# EAGLE design LED_8x8 (EAGLE 6.4)
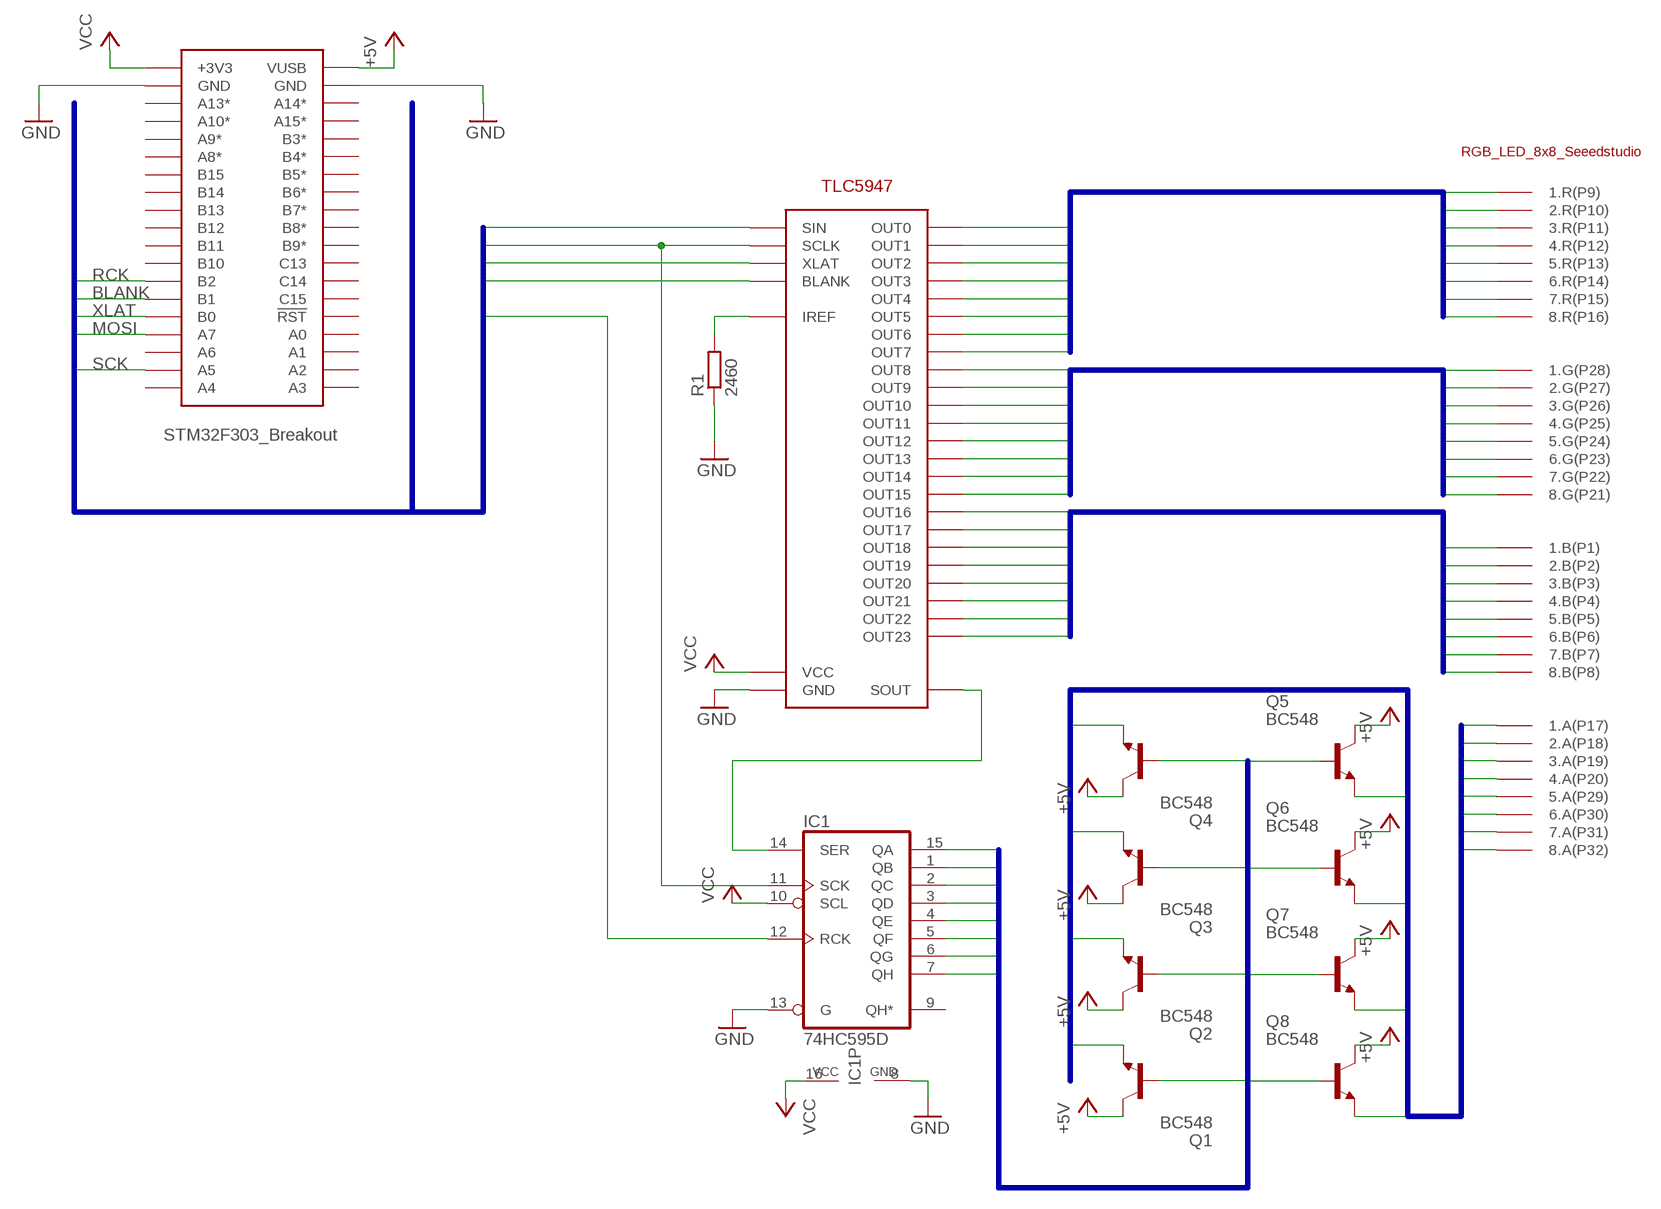
[diagram p0: schematic, sheet 1]

## Parts
IC1  74HC595D  [SO16]
Q1  BC548  [TO92-EBC]
Q2  BC548  [TO92-EBC]
Q3  BC548  [TO92-EBC]
Q4  BC548  [TO92-EBC]
Q5  BC548  [TO92-EBC]
Q6  BC548  [TO92-EBC]
Q7  BC548  [TO92-EBC]
Q8  BC548  [TO92-EBC]
R1  2460  R-EU_R0603  [R0603]
U$1  TLC5947  [TSSOP32]
U$2  STM32F303_BREAKOUT  [STM32_BREAKOUT]
U$3  LED_RGB_8X8  [LED_RGB_8X8]

## Nets
+5V: Q1.C Q2.C Q3.C Q4.C Q5.C Q6.C Q7.C Q8.C U$2.VUSB
BLANK: U$1.BLANK U$2.B1
BLUE1: U$1.OUT16 U$3.P1(1.B(P1))
BLUE2: U$1.OUT17 U$3.P2(2.B(P2))
BLUE3: U$1.OUT18 U$3.P3(3.B(P3))
BLUE4: U$1.OUT19 U$3.P4(4.B(P4))
BLUE5: U$1.OUT20 U$3.P5(5.B(P5))
BLUE6: U$1.OUT21 U$3.P6(6.B(P6))
BLUE7: U$1.OUT22 U$3.P7(7.B(P7))
BLUE8: U$1.OUT23 U$3.P8(8.B(P8))
GND: IC1.8(GND) IC1.13(G) R1.1 U$1.GND U$2.GND@1(GND) U$2.GND@2(GND)
GREEN1: U$1.OUT8 U$3.P28(1.G(P28))
GREEN2: U$1.OUT9 U$3.P27(2.G(P27))
GREEN3: U$1.OUT10 U$3.P26(3.G(P26))
GREEN4: U$1.OUT11 U$3.P25(4.G(P25))
GREEN5: U$1.OUT12 U$3.P24(5.G(P24))
GREEN6: U$1.OUT13 U$3.P23(6.G(P23))
GREEN7: U$1.OUT14 U$3.P22(7.G(P22))
GREEN8: U$1.OUT15 U$3.P21(8.G(P21))
MOSI: U$1.SIN U$2.A7
N$1: IC1.14(SER) U$1.SOUT
N$7: R1.2 U$1.IREF
POWERA1: Q1.E U$3.P17(1.A(P17))
POWERA2: Q2.E U$3.P18(2.A(P18))
POWERA3: Q3.E U$3.P19(3.A(P19))
POWERA4: Q4.E U$3.P20(4.A(P20))
POWERA5: Q5.E U$3.P29(5.A(P29))
POWERA6: Q6.E U$3.P30(6.A(P30))
POWERA7: Q7.E U$3.P31(7.A(P31))
POWERA8: Q8.E U$3.P32(8.A(P32))
RCK: IC1.12(RCK) U$2.B2
RED1: U$1.OUT0 U$3.P9(1.R(P9))
RED2: U$1.OUT1 U$3.P10(2.R(P10))
RED3: U$1.OUT2 U$3.P11(3.R(P11))
RED4: U$1.OUT3 U$3.P12(4.R(P12))
RED5: U$1.OUT4 U$3.P13(5.R(P13))
RED6: U$1.OUT5 U$3.P14(6.R(P14))
RED7: U$1.OUT6 U$3.P15(7.R(P15))
RED8: U$1.OUT7 U$3.P16(8.R(P16))
SCK: IC1.11(SCK) U$1.SCLK U$2.A5
SHIFTA1: IC1.15(QA) Q1.B
SHIFTA2: IC1.1(QB) Q2.B
SHIFTA3: IC1.2(QC) Q3.B
SHIFTA4: IC1.3(QD) Q4.B
SHIFTA5: IC1.4(QE) Q5.B
SHIFTA6: IC1.5(QF) Q6.B
SHIFTA7: IC1.6(QG) Q7.B
SHIFTA8: IC1.7(QH) Q8.B
VCC: IC1.10(SCL) IC1.16(VCC) U$1.VCC U$2.+3V3
XLAT: U$1.XLAT U$2.B0
Unconnected: IC1.9(QH*) U$2.!RST U$2.A0 U$2.A1 U$2.A2 U$2.A3 U$2.A4 U$2.A6 U$2.A8* U$2.A9* U$2.A10* U$2.A13* U$2.A14* U$2.A15* U$2.B3* U$2.B4* U$2.B5* U$2.B6* U$2.B7* U$2.B8* U$2.B9* U$2.B10 U$2.B11 U$2.B12 U$2.B13 U$2.B14 U$2.B15 U$2.C13 U$2.C14 U$2.C15

## Buses
RED[1..8]
GREEN[1..8]
BLUE[1..8]
CONTROLA[1..8]
POWERA[1..8]
MOSI,SCK,XLAT,BLANK,RCK

## Library data of the parts
IC1 = 74xx-eu:74*595: 8-bit SHIFT REGISTER, output latch
Q1-Q8 = transistor-npn:BC548*: NPN Transistor
R1 = rcl:R-EU_: RESISTOR, European symbol
U$1 = shack:TLC5947
U$2 = shack:STM32F303_BREAKOUT
U$3 = shack:LED_RGB_8X8

## Board
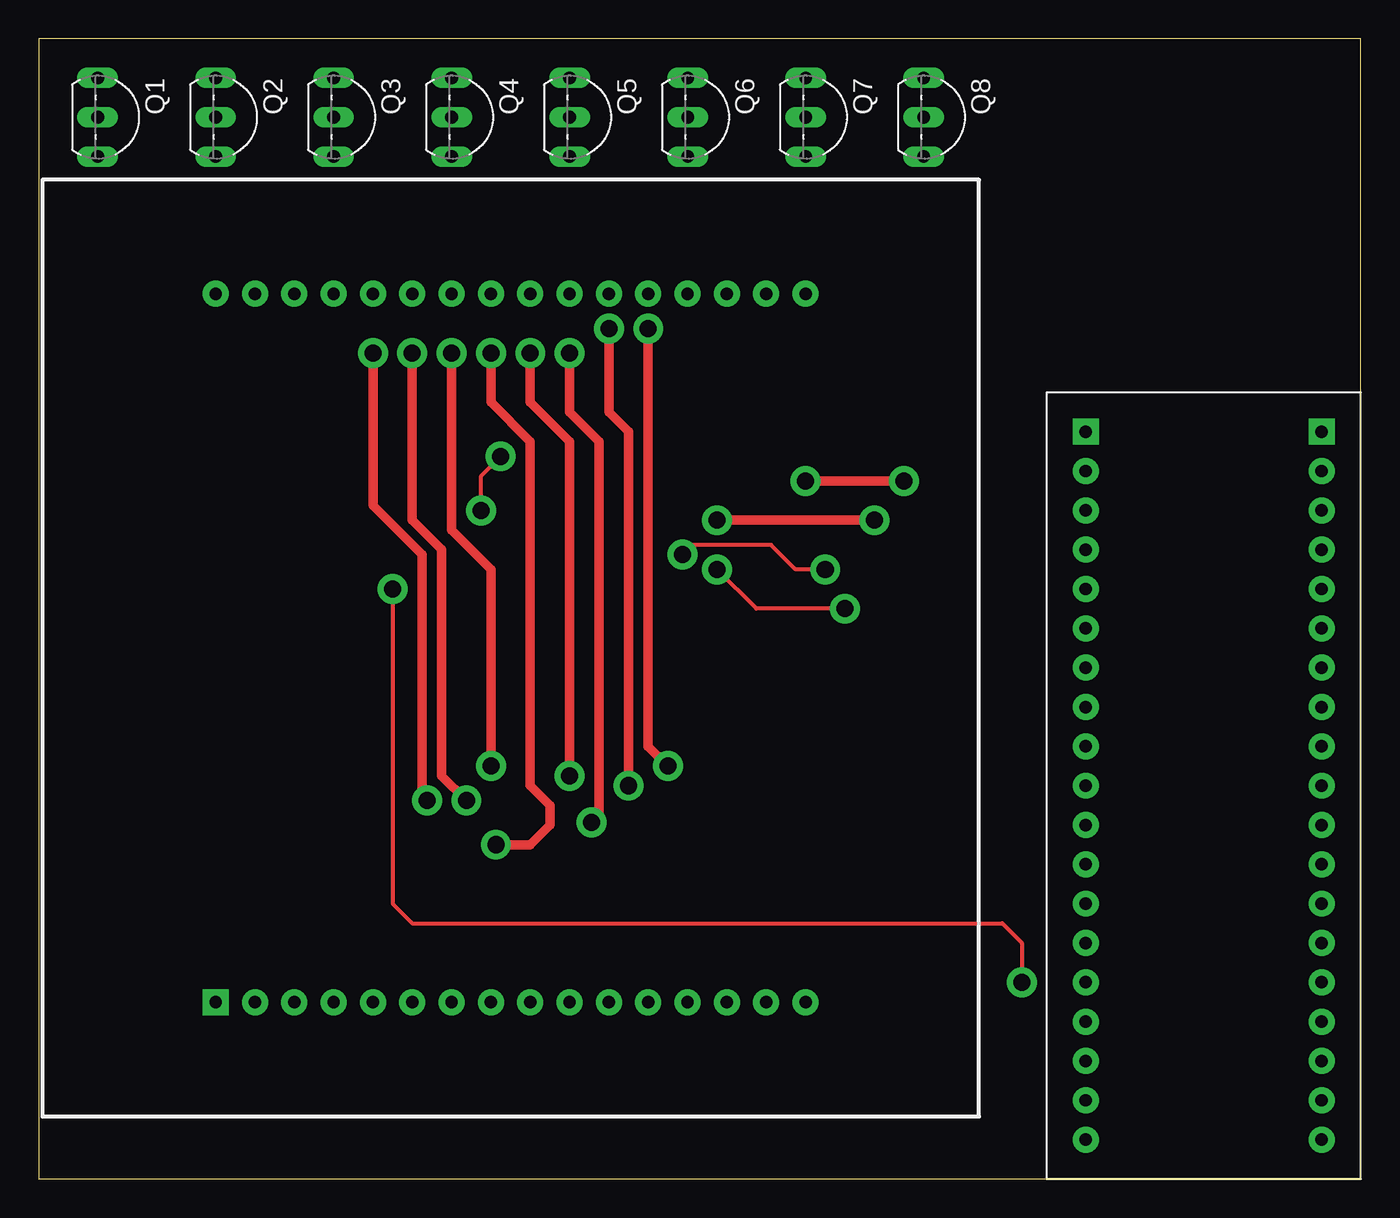
[diagram p1: board, top side]
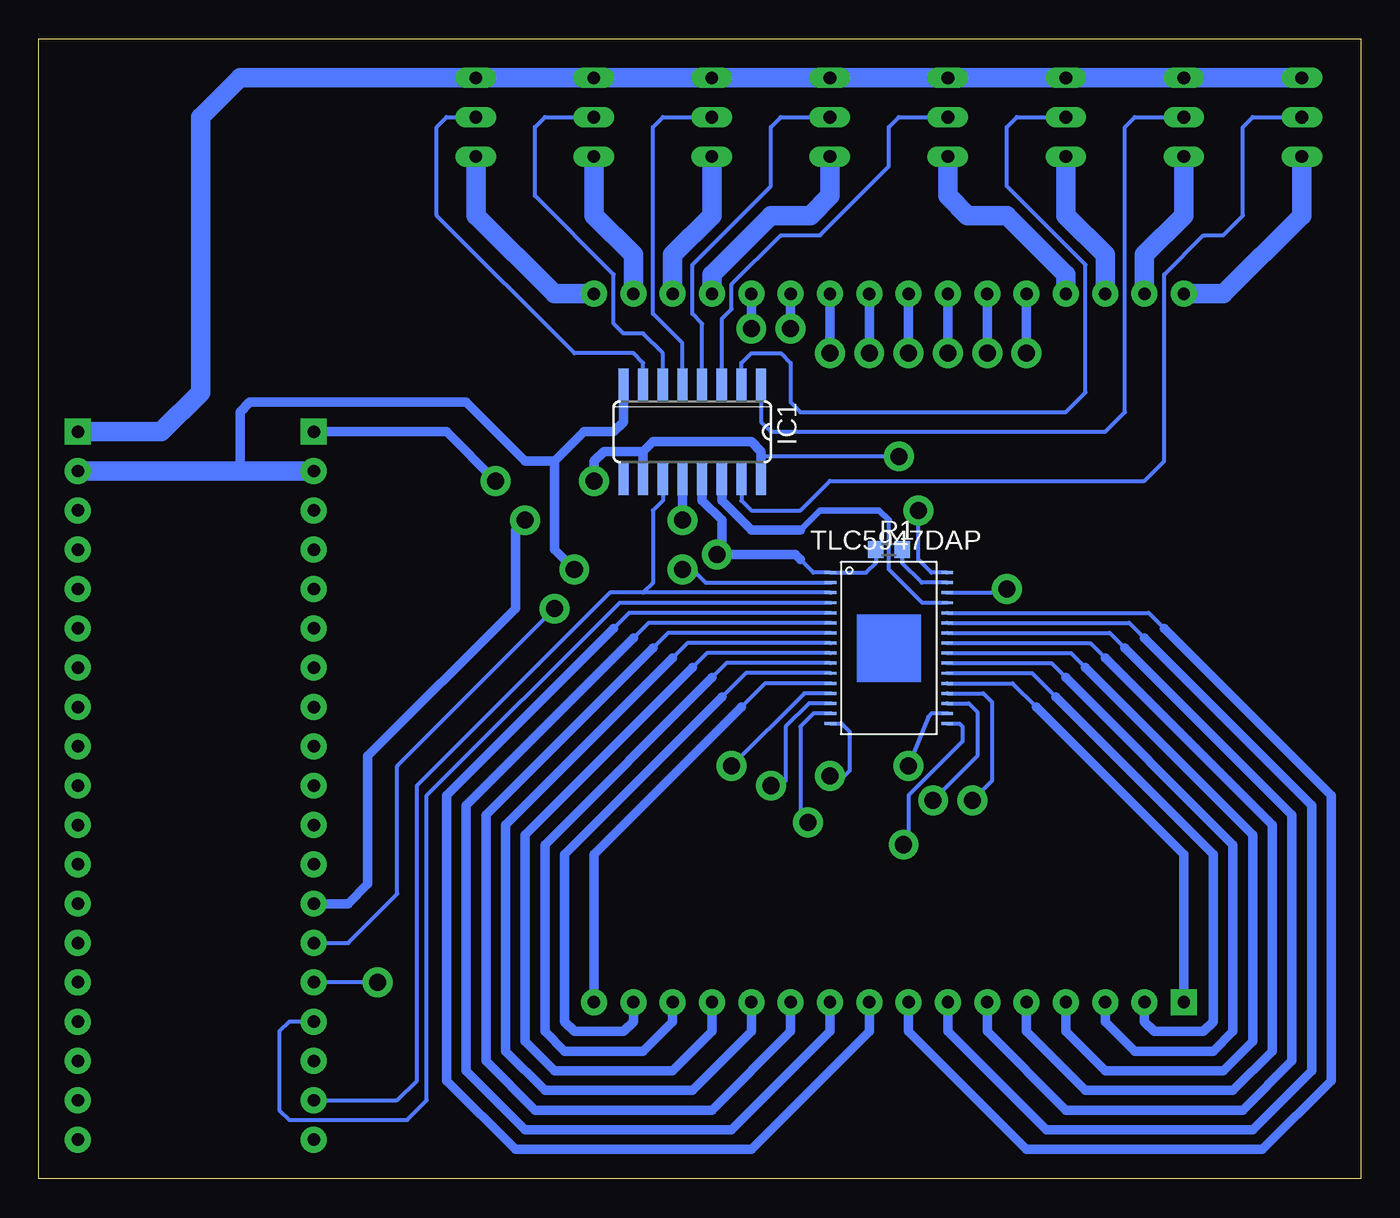
[diagram p2: board, bottom side, seen from below]

Size 85.39 x 73.65 mm. Coordinates in mm from the lower left corner, seen from the top.
Outline: 0,0 85.39,0 85.39,73.65 0,73.65 0,0
Copper layers (1*16): Top 0.035mm / dielectric 1.5mm / Bottom 0.035mm
Design rules "default": minimum track width 10mil, minimum drill 24mil, track to track 8mil, track to pad 8mil, pad to pad 8mil, via to via 8mil, smd to smd 8mil, copper to edge 40mil, drill to drill 8mil, minimum pad ring 10mil, minimum via ring 8mil, stop-mask expansion 4mil, vias tented up to drill 0mil, thermal gap 10mil

### Footprints (pad centres in the part's own frame; a part is rotated, then mirrored left to right if it is on the bottom)
SO16 = smd 0.66 x 2.032: 1 -4.445,-3.073; 2 -3.175,-3.073; 3 -1.905,-3.073; 4 -0.635,-3.073; 5 0.635,-3.073; 6 1.905,-3.073; 7 3.175,-3.073; 8 4.445,-3.073; 9 4.445,3.073; 10 3.175,3.073; 11 1.905,3.073; 12 0.635,3.073; 13 -0.635,3.073; 14 -1.905,3.073; 15 -3.175,3.073; 16 -4.445,3.073
TO92-EBC = drill 0.813 long: B 0,-1.27; C -2.54,-1.27; E 2.54,-1.27
R0603 = smd 1 x 1.1: 1 -0.85,0; 2 0.85,0
TSSOP32 = smd 0.75 x 0.19: BLANK -3.775,4.225; GND -3.775,4.875; IREF 3.775,4.225; OUT0 -3.775,2.275; OUT1 -3.775,1.625; OUT2 -3.775,0.975; OUT3 -3.775,0.325; OUT4 -3.775,-0.325; OUT5 -3.775,-0.975; OUT6 -3.775,-1.625; OUT7 -3.775,-2.275; OUT8 -3.775,-2.925; OUT9 -3.775,-3.575; OUT10 -3.775,-4.225; OUT11 -3.775,-4.875; OUT12 3.775,-4.875; OUT13 3.775,-4.225; OUT14 3.775,-3.575; OUT15 3.775,-2.925; OUT16 3.775,-2.275; OUT17 3.775,-1.625; OUT18 3.775,-0.975; OUT19 3.775,-0.325; OUT20 3.775,0.325; OUT21 3.775,0.975; OUT22 3.775,1.625; OUT23 3.775,2.275; SCLK -3.775,3.575; SIN -3.775,2.925; SOUT 3.775,2.925; VCC 3.775,4.875; XLAT 3.775,3.575
STM32_BREAKOUT = drill 0.8 pad 1.676: !RST 7.62,-12.7; A0 7.62,-15.24; A1 7.62,-17.78; A2 7.62,-20.32; A3 7.62,-22.86; A4 -7.62,-22.86; A5 -7.62,-20.32; A6 -7.62,-17.78; A7 -7.62,-15.24; A8* -7.62,10.16; A9* -7.62,12.7; A10* -7.62,15.24; A13* -7.62,17.78; A14* 7.62,17.78; A15* 7.62,15.24; B0 -7.62,-12.7; B1 -7.62,-10.16; B2 -7.62,-7.62; B3* 7.62,12.7; B4* 7.62,10.16; B5* 7.62,7.62; B6* 7.62,5.08; B7* 7.62,2.54; B8* 7.62,0; B9* 7.62,-2.54; B10 -7.62,-5.08; B11 -7.62,-2.54; B12 -7.62,0; B13 -7.62,2.54; B14 -7.62,5.08; B15 -7.62,7.62; C13 7.62,-5.08; C14 7.62,-7.62; C15 7.62,-10.16; GND@1 -7.62,20.32; GND@2 7.62,20.32 | drill 0.8 pad 1.676 square: +3V3 -7.62,22.86; VUSB 7.62,22.86
LED_RGB_8X8 = drill 0.8 pad 1.676 square: P1 -19.05,-22.88 | drill 0.8 pad 1.676: P2 -16.51,-22.88; P3 -13.97,-22.88; P4 -11.43,-22.88; P5 -8.89,-22.88; P6 -6.35,-22.88; P7 -3.81,-22.88; P8 -1.27,-22.88; P9 1.27,-22.88; P10 3.81,-22.88; P11 6.35,-22.88; P12 8.89,-22.88; P13 11.43,-22.88; P14 13.97,-22.88; P15 16.51,-22.88; P16 19.05,-22.88; P17 -19.05,22.88; P18 -16.51,22.88; P19 -13.97,22.88; P20 -11.43,22.88; P21 -8.89,22.88; P22 -6.35,22.88; P23 -3.81,22.88; P24 -1.27,22.88; P25 1.27,22.88; P26 3.81,22.88; P27 6.35,22.88; P28 8.89,22.88; P29 11.43,22.88; P30 13.97,22.88; P31 16.51,22.88; P32 19.05,22.88

### Placement (x,y rotation side)
IC1  43.18,48.26 180 bottom
Q1  5.08,68.58 270 top
Q2  12.7,68.58 270 top
Q3  20.32,68.58 270 top
Q4  27.94,68.58 270 top
Q5  35.56,68.58 270 top
Q6  43.18,68.58 270 top
Q7  50.8,68.58 270 top
Q8  58.42,68.58 270 top
R1  30.48,40.64 0 bottom
U$1  30.48,34.29 0 bottom
U$2  75.25,25.4 0 top
U$3  30.48,34.29 0 top

### Tracks (layer width: path | path; a pad name or v marks a point on that pad's centre or on a via)
+5V
  Bottom 1.27: U$2.VUSB 77.47,48.26 74.93,50.8 74.93,68.58 72.39,71.12 Q8.C Q7.C Q6.C Q5.C Q4.C Q3.C Q2.C Q1.C
BLANK  (via drill 1.1 pad 1.93)
  Top 0.254: v52.07,36.83 46.35,36.83 v43.81,39.37
  Bottom 0.254: U$2.B1 65.41,15.24 62.23,18.41 62.23,26.67 v52.07,36.83 | v43.81,39.37 43.18,39.37 42.33,38.52 U$1.BLANK
BLUE1
  Bottom 0.254: U$1.OUT16 22.49,32.02 20.95,30.48
  Bottom 0.61: U$3.P1 11.43,20.95 20.95,30.48
BLUE2
  Bottom 0.254: U$1.OUT17 21.23,32.66 19.68,31.11
  Bottom 0.61: U$3.P2 13.97,10.16 13.34,9.53 10.16,9.53 9.53,10.16 9.53,20.95 19.68,31.11
BLUE3
  Bottom 0.254: U$1.OUT18 19.98,33.31 19.05,32.38
  Bottom 0.61: U$3.P3 16.51,10.16 14.61,8.26 9.53,8.26 8.26,9.53 8.26,21.59 19.05,32.38
BLUE4
  Bottom 0.254: U$1.OUT19 18.73,33.97 17.78,33.02
  Bottom 0.61: U$3.P4 19.05,9.53 16.51,6.99 8.89,6.99 6.99,8.89 6.99,22.23 17.78,33.02
BLUE5
  Bottom 0.254: U$1.OUT20 17.47,34.62 16.51,33.66
  Bottom 0.61: U$3.P5 21.59,9.53 17.78,5.71 8.26,5.71 5.71,8.26 5.71,22.86 16.51,33.66
BLUE6
  Bottom 0.254: U$1.OUT21 16.21,35.27 15.24,34.29
  Bottom 0.61: U$3.P6 24.13,9.53 19.05,4.45 7.62,4.45 4.45,7.62 4.45,23.5 15.24,34.29
BLUE7
  Bottom 0.254: U$1.OUT22 14.96,35.91 13.97,34.92
  Bottom 0.61: U$3.P7 26.67,9.53 20.32,3.17 6.99,3.17 3.17,6.99 3.17,24.13 13.97,34.92
BLUE8
  Bottom 0.254: U$1.OUT23 13.71,36.56 12.7,35.56
  Bottom 0.61: U$3.P8 29.21,9.53 21.59,1.91 6.35,1.91 1.91,6.35 1.91,24.77 12.7,35.56
GND  (via drill 1.1 pad 1.93)
  Top 0.254: v50.8,39.37 48.9,39.37 47.31,40.96 42.23,40.96 v41.59,40.32
  Top 0.61: 41.91,40.64 v41.59,40.32
  Bottom 0.254: R1.1 31.33,39.79 31.95,39.16 U$1.GND 35.35,39.16 36.2,40.01
  Bottom 0.61: IC1.8 47.62,48.9 48.26,48.26 50.16,48.26 52.07,46.35 | 36.2,40.01 36.51,40.32 v41.59,40.32 41.27,40.64 41.27,42.55 42.55,43.81 IC1.13 | 52.07,46.35 52.07,40.64 v50.8,39.37 | 52.07,46.35 53.98,46.35 57.78,50.16 71.75,50.16 72.39,49.53 72.39,45.72
  Bottom 1.27: U$2.GND@1 72.39,45.72 U$2.GND@2
GREEN1  (via drill 1.1 pad 1.93)
  Top 0.61: v39.37,54.93 39.37,27.94 v40.64,26.67
  Bottom 0.254: U$1.OUT8 35.95,31.36 v40.64,26.67
  Bottom 0.61: U$3.P28 v39.37,54.93
GREEN2  (via drill 1.1 pad 1.93)
  Top 0.61: v36.83,54.93 36.83,49.53 38.1,48.26 v38.1,25.4
  Bottom 0.254: U$1.OUT9 35.64,30.71 37.15,29.21 37.15,25.72 37.47,25.4 v38.1,25.4
  Bottom 0.61: U$3.P27 v36.83,54.93
GREEN3  (via drill 1.1 pad 1.93)
  Top 0.61: v34.29,53.34 34.29,49.53 36.2,47.62 36.2,23.5 v35.72,23.02 35.56,22.86
  Bottom 0.254: U$1.OUT10 35.34,30.07 36.2,29.21 36.2,23.5 v35.72,23.02
  Bottom 0.61: U$3.P26 v34.29,53.34
GREEN4  (via drill 1.1 pad 1.93)
  Top 0.61: v31.75,53.34 31.75,50.16 34.29,47.62 v34.29,26.04
  Bottom 0.254: U$1.OUT11 33.54,29.41 33.02,28.89 33.02,26.35 33.34,26.04 v34.29,26.04
  Bottom 0.61: U$3.P25 v31.75,53.34
GREEN5  (via drill 1.1 pad 1.93)
  Top 0.61: v29.21,53.34 29.21,50.16 31.75,47.62 31.75,25.4 33.02,24.13 33.02,22.86 31.75,21.59 v29.53,21.59 29.21,21.59
  Bottom 0.254: U$1.OUT12 25.92,29.41 25.72,29.21 25.72,28.26 29.21,24.77 29.21,21.91 v29.53,21.59
  Bottom 0.61: U$3.P24 v29.21,53.34
GREEN6  (via drill 1.1 pad 1.93)
  Top 0.61: v26.67,53.34 26.67,41.91 29.21,39.37 v29.21,26.67
  Bottom 0.254: U$1.OUT13 27.72,30.07 27.94,29.84 v29.21,26.67
  Bottom 0.61: U$3.P23 v26.67,53.34
GREEN7  (via drill 1.1 pad 1.93)
  Top 0.61: v24.13,53.34 24.13,42.55 26.04,40.64 26.04,26.04 v27.62,24.45
  Bottom 0.254: U$1.OUT14 25.32,30.71 24.77,30.16 24.77,27.3 v27.62,24.45
  Bottom 0.61: U$3.P22 v24.13,53.34
GREEN8  (via drill 1.1 pad 1.93)
  Top 0.61: v21.59,53.34 21.59,43.5 24.77,40.32 24.77,24.77 v25.08,24.45
  Bottom 0.254: U$1.OUT15 24.38,31.36 23.81,30.8 23.81,25.72 v25.08,24.45
  Bottom 0.61: U$3.P21 v21.59,53.34
MOSI
  Bottom 0.254: U$2.A7 69.22,10.16 69.85,9.53 69.85,4.45 69.22,3.81 61.59,3.81 60.33,5.08 60.33,24.77 47.88,37.22 U$1.SIN
N$1
  Bottom 0.254: U$1.SOUT 28.32,37.22 30.48,39.37 30.48,42.55
  Bottom 0.406: 30.48,42.55 31.11,43.18 34.92,43.18 36.2,41.91
  Bottom 0.61: 36.2,41.91 39.37,41.91 41.27,43.81 IC1.14
N$7
  Bottom 0.254: U$1.IREF 28.36,38.52 29.63,39.79 R1.2
POWERA1
  Bottom 1.27: U$3.P17 8.87,57.17 3.81,62.23 Q1.E
POWERA2
  Bottom 1.27: U$3.P18 13.97,59.69 11.43,62.23 Q2.E
POWERA3
  Bottom 1.27: U$3.P19 16.51,59.69 19.05,62.23 Q3.E
POWERA4
  Bottom 1.27: U$3.P20 19.05,58.42 22.86,62.23 25.4,62.23 26.67,63.5 Q4.E
POWERA5
  Bottom 1.27: U$3.P29 41.91,58.42 38.1,62.23 35.56,62.23 34.29,63.5 Q5.E
POWERA6
  Bottom 1.27: U$3.P30 44.45,59.69 41.91,62.23 Q6.E
POWERA7
  Bottom 1.27: U$3.P31 46.99,59.69 49.53,62.23 Q7.E
POWERA8
  Bottom 1.27: U$3.P32 52.09,57.17 57.15,62.23 Q8.E
RCK  (via drill 1.1 pad 1.93)
  Top 0.61: v53.98,42.55 v43.81,42.55
  Bottom 0.61: U$2.B2 65.41,17.78 64.14,19.05 64.14,27.3 54.61,36.83 54.61,41.91 v53.98,42.55 | v43.81,42.55 IC1.12
RED1
  Bottom 0.254: U$1.OUT0 47.26,36.56 48.26,35.56
  Bottom 0.61: U$3.P9 31.75,9.53 39.37,1.91 54.61,1.91 59.05,6.35 59.05,24.77 48.26,35.56
RED2
  Bottom 0.254: U$1.OUT1 46,35.91 46.99,34.92
  Bottom 0.61: U$3.P10 34.29,9.53 40.64,3.17 53.98,3.17 57.78,6.99 57.78,24.13 46.99,34.92
RED3
  Bottom 0.254: U$1.OUT2 44.74,35.27 45.72,34.29
  Bottom 0.61: U$3.P11 36.83,9.53 41.91,4.45 53.34,4.45 56.52,7.62 56.52,23.5 45.72,34.29
RED4
  Bottom 0.254: U$1.OUT3 43.49,34.62 44.45,33.66
  Bottom 0.61: U$3.P12 39.37,9.53 43.18,5.71 52.7,5.71 55.24,8.26 55.24,22.86 44.45,33.66
RED5
  Bottom 0.254: U$1.OUT4 42.23,33.97 43.18,33.02
  Bottom 0.61: U$3.P13 41.91,9.53 44.45,6.99 52.07,6.99 53.98,8.89 53.98,22.23 43.18,33.02
RED6
  Bottom 0.254: U$1.OUT5 40.98,33.31 41.91,32.38
  Bottom 0.61: U$3.P14 44.45,10.16 46.35,8.26 51.44,8.26 52.7,9.53 52.7,21.59 41.91,32.38
RED7
  Bottom 0.254: U$1.OUT6 39.73,32.66 41.27,31.11
  Bottom 0.61: U$3.P15 46.99,10.16 47.62,9.53 50.8,9.53 51.44,10.16 51.44,20.95 41.27,31.11
RED8
  Bottom 0.254: U$1.OUT7 38.47,32.02 40.01,30.48
  Bottom 0.61: U$3.P16 49.53,20.95 40.01,30.48
SCK
  Bottom 0.254: U$1.SCLK 46.35,37.87 | 46.35,37.87 48.49,37.87 60.96,25.4 60.96,6.35 62.23,5.08 U$2.A5 | IC1.11 45.09,43.81 45.72,43.18 45.72,38.5 46.35,37.87
SHIFTA1
  Bottom 0.254: IC1.15 40.01,43.81 39.37,43.18 36.2,43.18 34.29,45.09 13.97,45.09 12.7,46.35 12.7,58.42 10.16,60.96 8.89,60.96 7.62,62.23 7.62,67.94 6.99,68.58 Q1.B
SHIFTA2
  Bottom 0.254: IC1.1 38.73,48.9 38.1,48.26 16.51,48.26 15.24,49.53 15.24,67.94 14.61,68.58 Q2.B
SHIFTA3
  Bottom 0.254: IC1.2 40.01,52.7 39.37,53.34 37.47,53.34 36.83,52.7 36.83,50.16 36.2,49.53 19.05,49.53 17.78,50.8 17.78,59.05 22.86,64.14 22.86,67.94 22.23,68.58 Q3.B
SHIFTA4
  Bottom 0.254: IC1.3 41.27,55.56 40.64,56.2 40.64,57.78 37.47,60.96 34.92,60.96 30.48,65.41 30.48,67.94 29.84,68.58 Q4.B
SHIFTA5
  Bottom 0.254: IC1.4 42.55,55.24 43.18,55.88 43.18,59.05 38.1,64.14 38.1,67.94 37.47,68.58 Q5.B
SHIFTA6
  Bottom 0.254: IC1.5 43.81,53.98 45.72,55.88 45.72,67.94 45.09,68.58 Q6.B
SHIFTA7
  Bottom 0.254: IC1.6 45.09,53.34 46.35,54.61 47.62,54.61 48.26,55.24 48.26,58.42 53.34,63.5 53.34,67.94 52.7,68.58 Q7.B
SHIFTA8
  Bottom 0.254: IC1.7 46.35,52.7 46.99,53.34 50.8,53.34 59.69,62.23 59.69,67.94 59.05,68.58 Q8.B
VCC  (via drill 1.1 pad 1.93)
  Top 0.254: v28.57,43.18 28.57,45.4 v29.84,46.67
  Top 0.61: v55.88,45.09 v49.53,45.09
  Bottom 0.254: U$1.VCC 27.73,39.16 28.57,40.01 v28.57,43.18 | v29.84,46.67 38.73,46.67
  Bottom 0.61: IC1.16 38.73,46.67 38.73,46.99 39.37,47.62 45.72,47.62 46.35,46.99 | 46.35,46.99 IC1.10 | U$2.+3V3 59.05,48.26 v55.88,45.09 | v49.53,45.09 49.53,46.35 48.9,46.99 46.35,46.99
XLAT  (via drill 1.1 pad 1.93)
  Top 0.254: v22.86,38.1 22.86,17.78 24.13,16.51 62.23,16.51 63.5,15.24 v63.5,12.7
  Bottom 0.254: U$1.XLAT 23.09,37.87 v22.86,38.1 | v63.5,12.7 U$2.B0